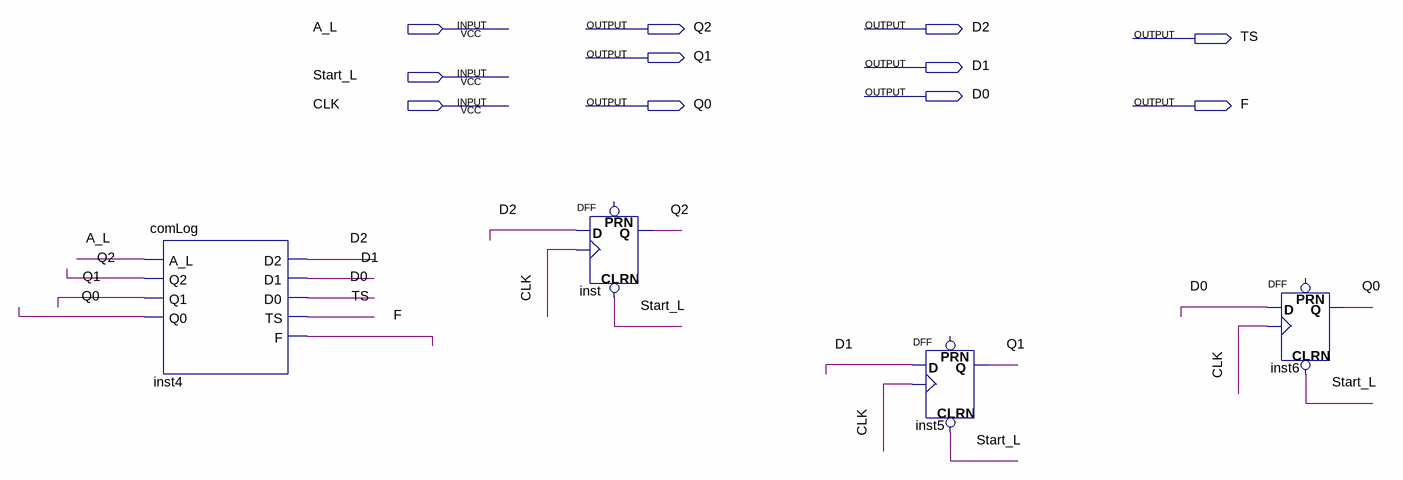
[diagram p0: schematic sheet]
// Quartus schematic Quiz5.bdf as structural Verilog: 4 symbols, 11 pins
module Quiz5 (
  input  A_L,
  input  Start_L,
  input  CLK,
  output Q2,
  output D2,
  output TS,
  output Q1,
  output D1,
  output D0,
  output Q0,
  output F
);

  comLog inst4 (.A_L(A_L), .Q2(Q2), .Q1(Q1), .Q0(Q0), .D2(D2), .D1(D1), .D0(D0), .TS(TS), .F(F));
  DFF inst (.CLRN(Start_L), .CLK(CLK), .D(D2), .Q(Q2));  // open: PRN
  DFF inst5 (.CLRN(Start_L), .CLK(CLK), .D(D1), .Q(Q1));  // open: PRN
  DFF inst6 (.CLRN(Start_L), .CLK(CLK), .D(D0), .Q(Q0));  // open: PRN
endmodule
